# EAGLE design Teensy 3Gshield lower board V0.97 (EAGLE 7.2.0)
DESIGNER: Rob Oudendijk; VERSION: V0.96
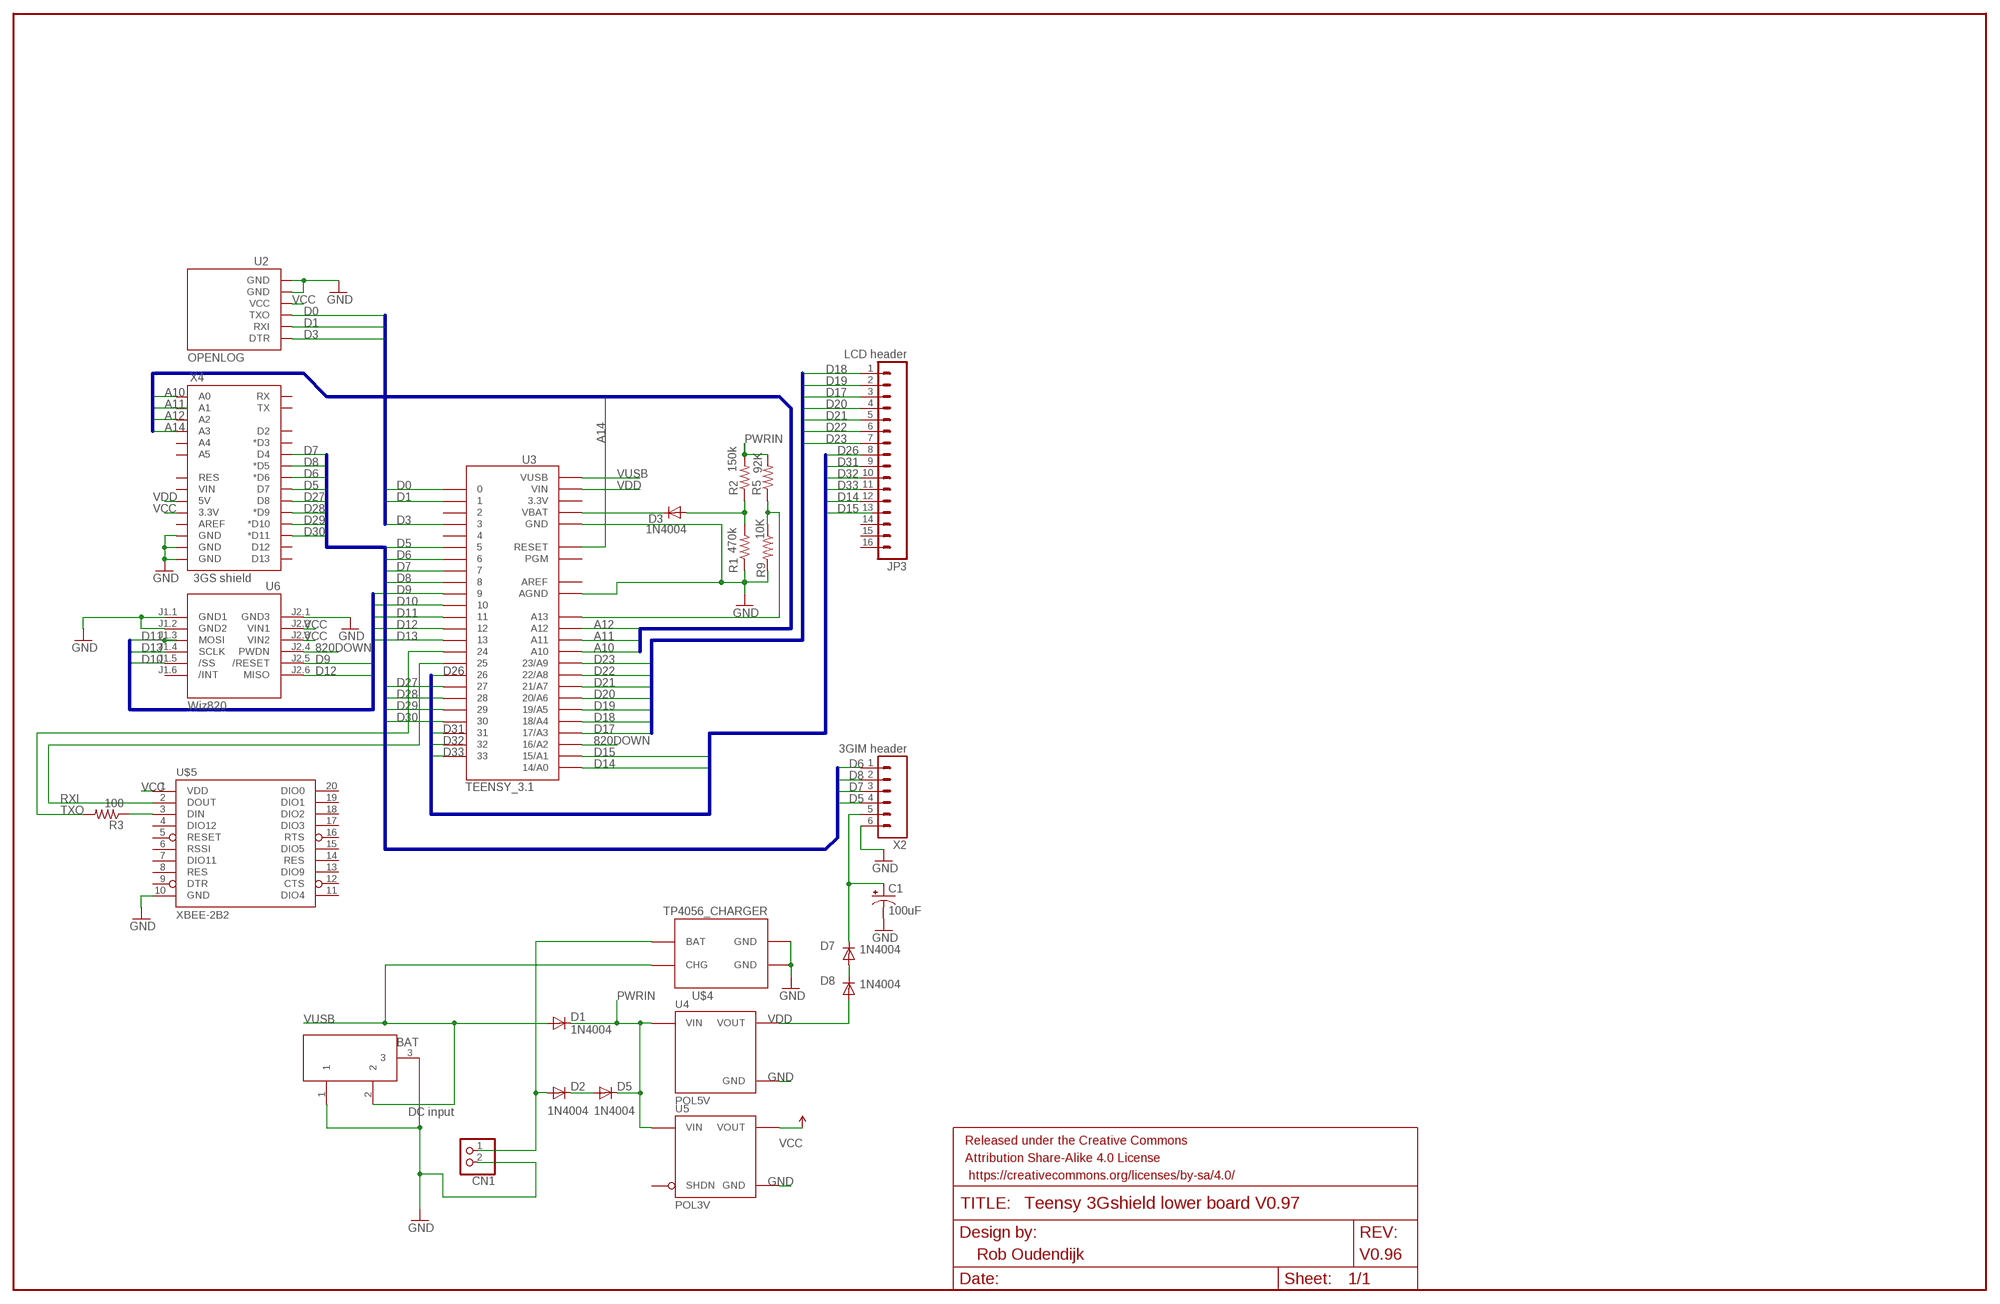
[diagram p0: schematic, sheet 1]

## Parts
C1  100uF  CAP_POLPTH1  [CPOL-RADIAL-100UF-25V]
CN1  JST_2PIN-THM-RA  [JST-PH-2-THM-RA]
D1  1N4004  [DO41-10]
D2  1N4004  [DO41-10]
D3  1N4004  [DO41-10]
D5  1N4004  [DO41-10]
D7  1N4004  [DO41-10]
D8  1N4004  [DO41-10]
DCINPUT  DC21MMX  [DC-21MM]
FRAME1  FRAME-LEDGER  [CREATIVE_COMMONS]
JP3  LCD header  M16PTH  [1X16]
R1  470k  RESISTOREZ  [AXIAL-0.3EZ]
R2  150k  RESISTOREZ  [AXIAL-0.3EZ]
R3  100  RESISTOREZ  [AXIAL-0.3EZ]
R5  92K  RESISTOREZ  [AXIAL-0.3EZ]
R9  10K  RESISTOREZ  [AXIAL-0.3EZ]
U2  OPENLOG  [OPENLOG]
U3  TEENSY_3.1  TEENSY_3.0_ALLPINS  [TEENSY_3.0_ALLPINS]
U4  POL5V  POLOLU_S7V8F5  [POLOLU_S7V8F5]
U5  POL3V  POLOLU_D24V3AXV  [POLOLU_D24VXAYV_HC]
U6  Wiz820  WIZ820IO_DEVICE'DUAL-IN-LINE'  [WIZ820IO]
U$4  TP4056_CHARGER  [TP4056]
U$5  XBEE-2B2  [XBEE-SILK]
X2  3GIM header  M06SILK_FEMALE_PTH  [1X06]
X4  3GS shield  ARDUINO_SHIELDLABEL  [DUEMILANOVE_SHIELD]

## Nets
820DOWN: U3.16/A2 U6.J2.4(PWDN)
A10: U3.A10 X4.A0
A11: U3.A11 X4.A1
A12: X4.A2
A14: U3.RESET X4.A3
BAT [VDD]: CN1.1 D2.A U$4.BAT
D0: U2.JP1$3(TXO) U3.0
D1: U2.JP1$2(RXI) U3.1
D3: U2.JP1$1(DTR) U3.3
D5: U3.5 X2.4 X4.D7
D6: U3.6 X2.1 X4.D6(*D6)
D7: U3.7 X2.3 X4.D4
D8: U3.8 X2.2 X4.D5(*D5)
D9: U3.9 U6.J2.5(/RESET)
D10: U3.10 U6.J1.5(/SS)
D11: U3.11 U6.J1.3(MOSI)
D12: U3.12 U6.J2.6(MISO)
D13: U3.13 U6.J1.4(SCLK)
D14: JP3.12 U3.14/A0
D15: U3.15/A1
D17: JP3.3 U3.17/A3
D18: JP3.1 U3.18/A4
D19: JP3.2 U3.19/A5
D20: JP3.4 U3.20/A6
D21: JP3.5 U3.21/A7
D22: JP3.6 U3.22/A8
D23: JP3.7 U3.23/A9
D26: JP3.8 U3.26
D27: U3.27 X4.D8
D28: U3.28 X4.D9(*D9)
D29: U3.29 X4.D10(*D10)
D30: U3.30 X4.D11(*D11)
D31: JP3.9 U3.31
D32: JP3.10 U3.32
D33: JP3.11 U3.33
GND [VCC]: C1.2(-) CN1.2 DCINPUT.1 DCINPUT.3 R1.P$1 R9.P$2 U2.JP1$5(GND) U2.JP1$6(GND) U3.AGND U3.GND U3.GND1(GND) U3.GND2(GND) U4.G(GND) U5.G(GND) U6.J1.1(GND1) U6.J1.2(GND2) U6.J2.1(GND3) U$4.GND U$4.GND2(GND) U$5.10(GND) X2.6 X4.GND@0(GND) X4.GND@1(GND) X4.GND@2(GND)
N$1: D3.C U3.VBAT
N$2: D3.A R1.P$2 R2.P$1
N$3: D2.C D5.A
N$8: R5.P$1 R9.P$1 U3.A13
N$10: R3.P$1 U$5.3(DIN)
N$31: D7.A D8.C
N$32: C1.1(+) D7.C X2.5
PWRIN [VDD]: D1.C D5.C R2.P$2 R5.P$2 U4.I(VIN) U5.I(VIN)
RXI: U3.25 U$5.2(DOUT)
TXO: R3.P$2 U3.24
VCC [VCC]: U2.JP1$4(VCC) U5.O(VOUT) U6.J2.2(VIN1) U6.J2.3(VIN2) U$5.1(VDD) X4.3.3V
VDD [VDD]: D8.A U3.VIN U4.O(VOUT) X4.5V
VUSB [VDD]: D1.A DCINPUT.2 U3.VUSB U$4.CHARGER(CHG)
Unconnected: JP3.13 JP3.14 JP3.15 JP3.16 U3.2 U3.3.3V U3.3.3V1(3.3V) U3.3.3V2(3.3V) U3.4 U3.A12 U3.PGM U5.S(SHDN) U6.J1.6(/INT) U$5.4(DIO12) U$5.5(RESET) U$5.6(RSSI) U$5.7(DIO11) U$5.8(RES) U$5.9(DTR) U$5.11(DIO4) U$5.12(CTS) U$5.13(DIO9) U$5.14(RES) U$5.15(DIO5) U$5.16(RTS) U$5.17(DIO3) U$5.18(DIO2) U$5.19(DIO1) U$5.20(DIO0) X4.A4 X4.A5 X4.AREF X4.D2 X4.D3(*D3) X4.D12 X4.D13 X4.RES X4.RX X4.TX X4.VIN

## Buses
D[17..23]
D[9..13]
D[0..3]
D[5..30]
A[10..14]
D[14..33]

## Notes on the sheet
- DC input

## Power pins joined to a net without a drawn wire
AREF: U3.AREF

## Library data of the parts
C1 = SparkFun-Capacitors:CAP_POL: Capacitor Polarized These are standard SMD and PTH capacitors. Normally 10uF, 47uF, and 100uF in electrolytic and tantalum varieties. Always verify the external diameter of the through hole cap, it varies with capacity, voltage, and manufacturer. The EIA devices should be standard.
CN1 = adafruit:JST_2PIN: JST 2-Pin Connectors of various flavors SMT-RA (S2B-PH-SM4) 4UConnector #17311 SMT (B2B-PH-SM4) THM-RA (S2B-PH) THM (B2B-PH)
D1-D3 D5 D7 D8 = adafruit:1N4004: DIODE General purpose 1N400x type rectifier (With bigger pads) http://www.ladyada.net/library/pcb/eaglelibrary.html
DCINPUT = powersupply:DC21MM
FRAME1 = SparkFun-Aesthetics:FRAME-LEDGER: Schematic Frame Standard 11x14 US Ledger frame
JP3 = SparkFun-Connectors:M16: 1x16 .1" header
R1-R3 = SparkFun-Resistors:RESISTOR: Resistor Basic schematic elements and footprints for 0603, 1206, and PTH resistors.
R5 R9 = SparkFun-Passives:RESISTOR: Resistor Basic schematic elements and footprints for 0603, 1206, and PTH resistors.
U2 = open_hw_sockets:OPENLOG: Openlog
U3 = Teensy3.0:TEENSY_3.0_ALLPINS: Teensy 3.0 with all pin holes and optional SMD-mount unshrouded header on bottom of Teensy 3.0. For more basic versions, see 'Basic', '+4' and 'AllAnalogPins'. Requires the installation of a un-shrouded SMD header on the underside of the Teensy 3.0
U4 = POLOLU1:POLOLU_S7V8F5: POLOLU_S7V8F5
U5 = Pololu:POLOLU_D24V3A*V: Pololu Adjustable Step Down Voltage Regulators Series D24V3A_V (300 mA) 0.4"x0.6" SOURCE www.pololu.com/ PACKAGE THT; 4-pin (0.1"); 0.4"x0.6" TECHNOLOGIES D24V3A…V Vi = (4.5…42)V Vo/V (Vo < Vi) X: (generic) L: (2.5… 7.5) H: (4.0…25.0) Io: 300 mA; Quiescent Current: 2 mA (SHDN: 20 uA) Author: Dipl.-Ing. FH Rainer Bayer
U6 = Wiz820io:WIZ820IO_DEVICE: WIZnet, WIZ820io plug in module incl. W5200 chip and MagJack
U$4 = open_hw_sockets:TP4056_CHARGER: TP4056
U$5 = SparkFun-RF:XBEE-2: Xbee module footprints SMT header is CONN-09042.
X2 = SparkFun-Connectors:M06: Header 6 Standard 6-pin 0.1" header. Use with straight break away headers (SKU : PRT-00116), right angle break away headers (PRT-00553), swiss pins (PRT-00743), machine pins (PRT-00117), and female headers (PRT-00115). Molex polarized connector foot print use with SKU : PRT-08094 with associated crimp pins and housings. NOTES ON THE VARIANTS LOCK and LOCK_LONGPADS... This footprint was designed to help hold the alignment of a through-hole component (i.e. 6-pin header) while soldering it into place. You may notice that each hole has been shifted either up or down by 0.005 of an inch from it's more standard position (which is a perfectly straight line). This slight alteration caused the pins (the squares in the middle) to touch the edges of the holes. Because they are alternating, it causes a "brace" to hold the component in place. 0.005 has proven to be the perfect amount of "off-center" position when using our standard breakaway headers. Although looks a little odd when you look at the bare footprint, once you have a header in there, the alteration is very hard to notice. Also,if you push a header all the way into place, it is covered up entirely on the bottom side. This idea of altering the position of holes to aid alignment will be further integrated into the Sparkfun Library for other footprints. It can help hold any component with 3 or more connection pins.; PROD_ID: CONN-08437
X4 = SparkFun-Boards:ARDUINO_SHIELD: Arduino shield footprint

## Net classes
0 default: width 0.406 mm, drill 0.254 mm, clearance 0.305 mm
1 VCC: width 0.7 mm, drill 0.254 mm, clearance 0.305 mm to class 0, clearance 0.205 mm
2 GND: width 0.7 mm, drill 0.254 mm, clearance 0.305 mm to class 0, clearance 0.205 mm to class 1
3 VDD: width 0.7 mm, drill 0.254 mm, clearance 0.305 mm to class 0, clearance 0.205 mm to class 1

## Board
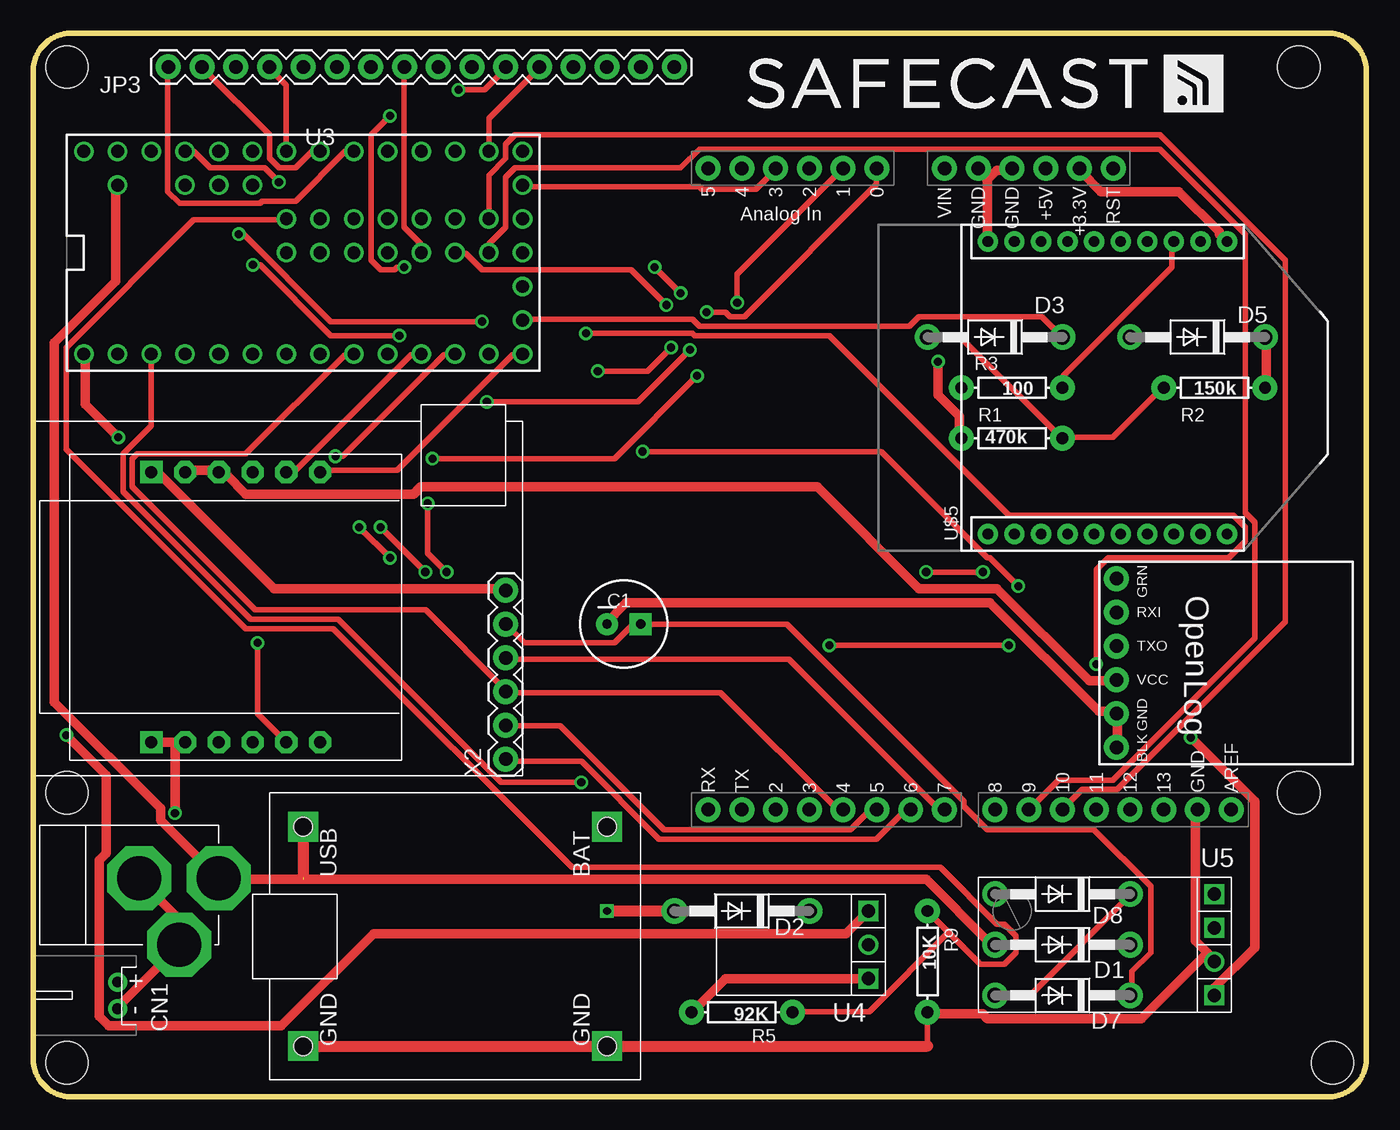
[diagram p1: board, top side]
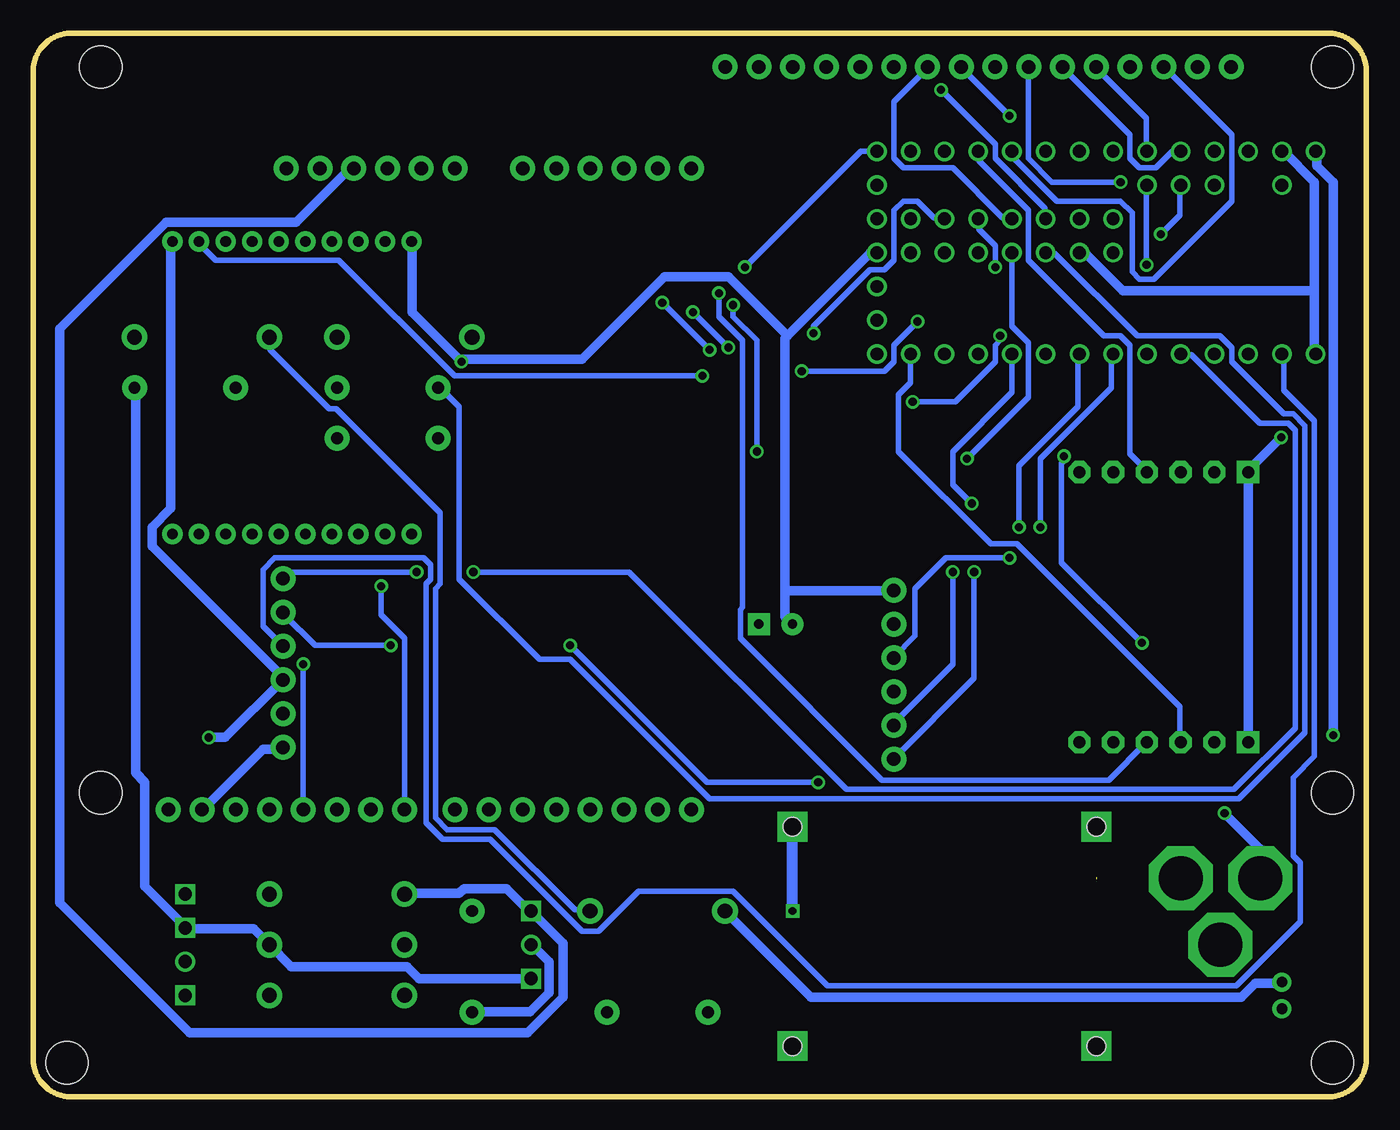
[diagram p2: board, bottom side, seen from below]

Size 100.33 x 80.01 mm. Coordinates in mm from the lower left corner, seen from the top.
Outline: 97.49,0 2.84,0 arc-90 0,2.84 0,77.17 arc-90 2.84,80.01 97.49,80.01 arc-90 100.33,77.17 100.33,2.84 arc-90 97.49,0
Copper layers (1*16): Top 0.035mm / dielectric 1.5mm / Bottom 0.035mm
Design rules "default": minimum track width 10mil, minimum drill 24mil, track to track 8mil, track to pad 8mil, pad to pad 8mil, via to via 8mil, smd to smd 8mil, copper to edge 40mil, drill to drill 8mil, minimum pad ring 10mil, minimum via ring 8mil, stop-mask expansion 4mil, vias tented up to drill 0mil, thermal gap 10mil
Holes 3.2 mm at 95.25,77.47 97.79,2.54 2.54,2.54 2.54,77.47 2.54,22.86 95.25,22.86

### Footprints (pad centres in the part's own frame; a part is rotated, then mirrored left to right if it is on the bottom)
CPOL-RADIAL-100UF-25V = drill 0.7 pad 1.651 square: 1 1.27,0 | drill 0.7 pad 1.651: 2 -1.27,0
JST-PH-2-THM-RA = drill 0.8 pad 1.422: 1 1,0; 2 -1,0
DO41-10 = drill 1.118 pad 1.93: A 5.08,0; C -5.08,0
DC-21MM = drill 3.302 pad 4.826 octagon: 1 -5.08,-3.353; 2 -0.076,-6.35; 3 -0.076,-0.356
1X16 = drill 1.016 pad 1.88: 1 0,0; 2 2.54,0; 3 5.08,0; 4 7.62,0; 5 10.16,0; 6 12.7,0; 7 15.24,0; 8 17.78,0; 9 20.32,0; 10 22.86,0; 11 25.4,0; 12 27.94,0; 13 30.48,0; 14 33.02,0; 15 35.56,0; 16 38.1,0
AXIAL-0.3EZ = drill 0.9 pad 1.88: P$1 -3.81,0; P$2 3.81,0
OPENLOG = drill 1.016 pad 1.88: JP1$1 1.27,1.27; JP1$2 3.81,1.27; JP1$3 6.35,1.27; JP1$4 8.89,1.27; JP1$5 11.43,1.27; JP1$6 13.97,1.27
TEENSY_3.0_ALLPINS = drill 0.965: 0 -7.62,13.97; 1 -7.62,11.43; 2 -7.62,8.89; 3 -7.62,6.35; 3.3V 7.62,11.43; 3.3V1 -2.54,-16.51; 3.3V2 2.54,-1.27; 4 -7.62,3.81; 5 -7.62,1.27; 6 -7.62,-1.27; 7 -7.62,-3.81; 8 -7.62,-6.35; 9 -7.62,-8.89; 10 -7.62,-11.43; 11 -7.62,-13.97; 12 -7.62,-16.51; 13 7.62,-16.51; 14/A0 7.62,-13.97; 15/A1 7.62,-11.43; 16/A2 7.62,-8.89; 17/A3 7.62,-6.35; 18/A4 7.62,-3.81; 19/A5 7.62,-1.27; 20/A6 7.62,1.27; 21/A7 7.62,3.81; 22/A8 7.62,6.35; 23/A9 7.62,8.89; 24 0,-3.81; 25 0,-6.35; 26 0,-8.89; 27 0,-11.43; 28 0,-13.97; 29 2.54,-13.97; 30 2.54,-11.43; 31 2.54,-8.89; 32 2.54,-6.35; 33 2.54,-3.81; A10 5.08,6.35; A11 5.08,3.81; A12 0,1.27; A13 2.54,1.27; AGND 7.62,13.97; AREF 5.08,8.89; GND -7.62,16.51; GND1 0,-16.51; GND2 0,-1.27; PGM 2.54,-16.51; RESET 5.08,-16.51; VBAT -5.08,-16.51; VIN 7.62,16.51; VUSB 5.08,13.97
POLOLU_S7V8F5 = drill 1: G 0,-5.715 | drill 1 square: I -2.54,-5.715; O 2.54,-5.715
POLOLU_D24VXAYV_HC = drill 1: G -1.27,-8.89 | drill 1 square: I 1.27,-8.89; O -3.81,-8.89; S 3.81,-8.89
WIZ820IO = drill 0.9 pad 1.676 square: J1.1 -10.16,6.35; J2.1 10.16,6.35 | drill 0.9 pad 1.676 octagon: J1.2 -10.16,3.81; J1.3 -10.16,1.27; J1.4 -10.16,-1.27; J1.5 -10.16,-3.81; J1.6 -10.16,-6.35; J2.2 10.16,3.81; J2.3 10.16,1.27; J2.4 10.16,-1.27; J2.5 10.16,-3.81; J2.6 10.16,-6.35
TP4056 = drill 1.5 square: BAT 7.62,-12.7; CHARGER 7.62,10.16; GND -8.89,10.16; GND2 -8.89,-12.7 | hole 1.4: -8.89,10.16; 7.62,10.16; 7.62,-12.7; -8.89,-12.7
XBEE-SILK = drill 0.8 pad 1.524: 1 -11,20; 2 -11,18; 3 -11,16; 4 -11,14; 5 -11,12; 6 -11,10; 7 -11,8; 8 -11,6; 9 -11,4; 10 -11,2; 11 11,2; 12 11,4; 13 11,6; 14 11,8; 15 11,10; 16 11,12; 17 11,14; 18 11,16; 19 11,18; 20 11,20
1X06 = drill 1.016 pad 1.88: 1 0,0; 2 2.54,0; 3 5.08,0; 4 7.62,0; 5 10.16,0; 6 12.7,0
DUEMILANOVE_SHIELD = drill 1.016 pad 1.88: 3.3V 12.7,27.94; 5V 10.16,27.94; A0 -2.54,27.94; A1 -5.08,27.94; A2 -7.62,27.94; A3 -10.16,27.94; A4 -12.7,27.94; A5 -15.24,27.94; AREF 24.13,-20.32; D2 -10.16,-20.32; D3 -7.62,-20.32; D4 -5.08,-20.32; D5 -2.54,-20.32; D6 0,-20.32; D7 2.54,-20.32; D8 6.35,-20.32; D9 8.89,-20.32; D10 11.43,-20.32; D11 13.97,-20.32; D12 16.51,-20.32; D13 19.05,-20.32; GND@0 7.62,27.94; GND@1 5.08,27.94; GND@2 21.59,-20.32; RES 15.24,27.94; RX -15.24,-20.32; TX -12.7,-20.32; VIN 2.54,27.94

### Placement (x,y rotation side)
C1  44.45,35.56 0 top
CN1  6.35,7.62 90 top
D1  77.47,11.43 180 top
D2  53.34,13.97 180 top
D3  72.39,57.15 180 top
D5  87.63,57.15 180 top
D7  77.47,7.62 180 top
D8  77.47,15.24 180 top
DCINPUT  7.62,16.51 90 top
FRAME1  74.93,66.67 0 top
JP3  10.16,77.47 0 top
R1  73.66,49.53 0 top
R2  88.9,53.34 0 top
R3  73.66,53.34 180 top
R5  53.34,6.35 180 top
R9  67.31,10.16 270 top
U2  80.25,40.26 270 top
U3  20.32,63.5 90 top
U4  57.15,11.43 90 top
U5  80.01,11.43 90 top
U6  15.24,36.83 90 top
U$4  30.48,12.7 90 top
U$5  69.85,53.34 270 top
U$10  [SAFECAST_LOGO1]  53.34,73.66 0 top
X2  35.56,25.4 90 top
X4  66.04,41.91 0 top

### Tracks (layer width: path | path; a pad name or v marks a point on that pad's centre or on a via)
820DOWN
  Bottom 0.406: U3.16/A2 29.16,71.12 29.16,70.41 25.43,66.67 25.43,62.94 19.74,57.25 18.49,57.25 17.78,56.54 17.78,48.36 16.54,47.12 U6.J2.4
A10  (via drill 0.61)
  Top 0.406: v15.47,64.9 15.82,64.9 22.4,58.32 v33.78,58.32 | v42.49,54.59 46.23,54.59 v48.01,56.36 | v50.67,59.03 52.09,59.03 52.45,58.67 53.52,58.67 63.48,68.63 63.48,69.7 X4.A0
  Bottom 0.406: v15.47,64.9 14.05,66.32 14.05,68.45 U3.A10 | v33.78,58.32 35.56,56.54 35.56,55.3 36.27,54.59 v42.49,54.59 | v50.67,59.03 v48.01,56.36
A11  (via drill 0.61)
  Top 0.406: v16.54,62.59 17.07,62.59 22.4,57.25 v27.56,57.25 | v34.14,52.27 45.52,52.27 v49.43,56.19 | v52.98,59.74 52.98,61.87 X4.A1
  Bottom 0.406: v16.54,62.59 16.54,68.45 U3.A11 | v27.56,57.25 27.56,56.9 27.91,56.54 27.91,55.3 30.94,52.27 v34.14,52.27 | v52.98,59.74 v49.43,56.19
A14
  Top 0.406: U3.RESET 36.98,68.45 50.14,68.45 50.32,68.28 54.41,68.28 55.83,69.7 X4.A3
BAT  (via drill 0.6)
  Top 0.813: D2.A v43.18,13.97
  Bottom 0.7: CN1.1 6.4,8.53 8.36,8.53 9.42,7.47 41.78,7.47 48.18,13.87 D2.A
  Bottom 0.813: v43.18,13.97 U$4.BAT
D0
  Bottom 0.406: U3.0 6.22,55.83 6.22,53.16 3.91,50.85 3.91,25.6 5.51,24 5.51,18.14 4.98,17.6 4.98,13.16 9.78,8.36 40.54,8.36 47.65,15.47 54.76,15.47 57.78,12.45 59.03,12.45 65.96,19.38 69.52,19.38 70.76,20.62 70.76,38.58 70.41,38.94 70.41,40.01 70.94,40.54 82.14,40.54 83.03,39.65 83.03,35.38 81.61,33.96 U2.JP1$3
D1  (via drill 0.61)
  Top 0.406: U3.1 8.89,50.49 6.76,48.36 6.76,45.52 16.36,35.92 22.94,35.92 35.2,23.65 v41.25,23.65 | v73.43,33.96 v59.92,33.96
  Bottom 0.406: v41.25,23.65 49.61,23.65 v59.92,33.96 | v73.43,33.96 79.12,33.96 81.43,36.27 U2.JP1$2
D3  (via drill 0.61)
  Top 0.406: v71.48,39.47 v67.21,39.47
  Bottom 0.406: v67.21,39.47 55.47,39.47 39.12,23.11 9.96,23.11 5.33,27.74 5.33,50.14 5.87,50.67 8,50.67 13.16,55.83 13.87,55.83 U3.3 | v71.48,39.47 81.08,39.47 81.43,39.12 U2.JP1$1
D5  (via drill 0.61)
  Top 0.406: v26.85,40.54 v24.54,42.85 | X4.D7 68.45,21.69 68.1,21.69 56.9,32.89 35.56,32.89 X2.4
  Bottom 0.406: v24.54,42.85 24.54,48.01 19.2,53.34 19.2,55.83 U3.5 | v26.85,40.54 31.65,40.54 33.96,38.23 33.96,34.67 35.56,33.07 X2.4
D6  (via drill 0.61)
  Top 0.406: v29.52,39.47 v26.14,42.85 | X4.D6 65.96,21.51 65.61,21.51 63.48,19.38 47.12,19.38 41.25,25.25 35.56,25.25 X2.1
  Bottom 0.406: v26.14,42.85 26.14,47.47 21.69,51.92 21.69,55.83 U3.6 | v29.52,39.47 29.52,31.47 35.56,25.43 X2.1
D7
  Top 0.406: U3.7 24,55.83 23.47,55.83 16,48.36 7.82,48.36 7.47,48.01 7.47,45.87 16.71,36.63 29.52,36.63 35.56,30.58 X2.3 35.74,30.4 51.74,30.4 60.45,21.69 60.81,21.69 X4.D4
D8  (via drill 0.61)
  Top 0.406: v29.69,44.63 29.69,40.89 v31.11,39.47 | X4.D5 63.48,21.51 62.94,21.51 61.52,20.09 47.47,20.09 39.65,27.91 35.56,27.91 X2.2
  Bottom 0.406: U3.8 26.67,52.98 31.11,48.54 31.11,46.05 v29.69,44.63 | v31.11,39.47 31.11,32.54 35.56,28.09 X2.2
D9
  Top 0.406: U3.9 29.16,55.83 28.45,55.83 19.74,47.12 19.2,47.12 U6.J2.5
D10  (via drill 0.61)
  Top 0.406: v22.76,48.18 23.29,48.18 30.94,55.83 31.65,55.83 U3.10 | v16.89,34.14 16.89,28.8 19.02,26.67 U6.J1.5
  Bottom 0.406: v22.76,48.18 22.76,47.83 22.94,47.65 22.94,40.18 v16.89,34.14
D11
  Bottom 0.406: U3.11 34.31,55.83 34.31,53.7 35.2,52.81 35.2,48.54 28.27,41.6 26.31,41.6 14.05,29.34 14.05,26.67 U6.J1.3
D12
  Top 0.406: U3.12 36.8,55.83 36.09,55.83 27.38,47.12 21.69,47.12 U6.J2.6
D13  (via drill 0.61)
  Top 0.406: v48.72,60.45 v46.76,62.41
  Bottom 0.406: U3.13 38.05,71.12 v46.76,62.41 | v48.72,60.45 48.72,58.67 46.94,56.9 46.94,36.8 47.12,36.63 47.12,34.49 36.45,23.82 19.38,23.82 16.54,26.67 U6.J1.4
D14
  Top 0.406: U3.14/A0 34.31,71.12 34.31,73.61 38.05,77.34 JP3.12
D17
  Bottom 0.406: U3.17/A3 26.67,70.76 23.29,67.39 18.49,67.39 17.6,66.5 17.6,62.05 17.07,61.52 16,61.52 10.13,67.39 10.13,72.36 JP3.3
D18
  Top 0.406: U3.18/A4 23.47,71.12 19.74,67.39 17.25,67.39 17.07,67.21 11.02,67.21 10.13,68.1 10.13,77.34 JP3.1
D19
  Top 0.406: U3.19/A5 20.98,71.12 19.74,69.88 18.49,69.88 17.78,70.59 17.78,72.36 12.8,77.34 JP3.2
D20
  Top 0.406: U3.20/A6 19.02,71.12 19.02,76.1 17.78,77.34 JP3.4
D21
  Bottom 0.406: U3.21/A7 16.54,71.12 16.54,73.61 20.27,77.34 JP3.5
D22
  Bottom 0.406: U3.22/A8 14.58,71.12 15.82,69.88 17.07,69.88 17.78,70.59 17.78,72.36 22.76,77.34 JP3.6
D23  (via drill 0.61)
  Top 0.406: U3.23/A9 12.09,71.12 13.34,69.88 17.42,69.88 v18.49,68.81
  Bottom 0.406: v18.49,68.81 23.65,68.81 25.43,70.59 25.43,77.34 JP3.7
D26
  Top 0.406: U3.26 29.16,63.65 29.16,64.19 27.91,65.43 27.91,77.34 JP3.8
D27  (via drill 0.61)
  Top 0.406: v47.65,59.56 44.98,62.23 33.78,62.23 32.54,63.48 31.83,63.48 U3.27 | v45.87,48.54 63.83,48.54 71.83,40.54 72.01,40.54 v74.14,38.41
  Bottom 0.406: v47.65,59.56 47.65,58.67 45.87,56.9 v45.87,48.54 | v74.14,38.41 74.14,36.27 72.36,34.49 72.36,21.69 X4.D8
D28
  Top 0.406: X4.D9 77.17,23.82 81.25,23.82 91.92,34.49 91.92,43.2 91.21,43.92 91.21,64.9 84.81,71.3 50.14,71.3 48.72,69.88 36.27,69.88 35.56,69.16 35.56,65.43 34.31,64.19 34.31,63.65 U3.28
D29
  Top 0.406: U3.29 34.31,66.14 34.31,69.34 35.56,70.59 35.56,71.65 36.27,72.36 84.81,72.36 94.23,62.94 94.23,35.74 81.61,23.11 78.94,23.11 77.52,21.69 X4.D10
D30  (via drill 0.61)
  Top 0.406: v41.6,57.43 49.61,57.43 49.78,57.25 59.92,57.25 73.43,43.74 90.32,43.74 91.21,42.85 91.21,41.78 89.97,40.54 80.9,40.54 80.01,39.65 v80.01,32.54
  Bottom 0.406: v41.6,57.43 41.6,57.96 37.34,62.23 36.27,62.23 35.56,62.94 35.56,66.67 34.85,67.39 33.78,67.39 32.54,66.14 31.83,66.14 U3.30 | X4.D11 v80.01,32.54
D31  (via drill 0.61)
  Top 0.406: v27.91,62.41 27.38,62.41 27.2,62.23 26.14,62.23 25.43,62.94 25.43,72.36 v26.85,73.79
  Bottom 0.406: v27.91,62.41 27.91,64.01 29.16,65.25 29.16,65.96 U3.31 | v26.85,73.79 30.4,77.34 JP3.9
D32
  Bottom 0.406: U3.32 26.67,66.14 27.38,66.14 31.11,69.88 34.85,69.88 35.56,70.59 35.56,74.85 33.07,77.34 JP3.10
D33  (via drill 0.61)
  Top 0.406: v32,75.74 33.96,75.74 35.56,77.34 JP3.11
  Bottom 0.406: v32,75.74 27.91,71.65 27.91,70.59 24.18,66.85 24.18,66.14 U3.33
GND  (via drill 0.61)
  Top 0.406: 67.31,3.81 R9.P$2
  Top 0.7: U2.JP1$6 81.61,26.31 81.61,28.8 U2.JP1$5 81.25,28.98 80.19,28.98 72.01,37.16 44.63,37.16 43.03,35.56 C1.2 | 88.37,10.85 87.48,11.73 87.48,21.51 X4.GND@2 | 88.37,10.85 88.9,10.31 U5.G | 88.37,10.85 83.39,5.87 71.83,5.87 71.48,6.22 67.39,6.22 R9.P$2 | CN1.2 6.4,6.76 11.02,11.38 DCINPUT.1 10.85,11.73 10.85,13.51 8,16.36 DCINPUT.3 | 71.83,68.99 71.83,64.36 U$5.10 | 71.83,68.99 71.12,69.7 X4.GND@1 | v68.1,55.3 68.1,52.81 69.7,51.21 69.7,49.61 R1.P$1 | 71.83,68.99 72.54,69.7 73.61,69.7 X4.GND@0 | U6.J1.1 U6.J1.2 10.67,26.49 v10.67,21.34 | U6.J2.1 8.89,46.94 9.42,46.94 18.14,38.23 35.56,38.23 X2.6 | v6.4,49.61 3.91,52.09 3.91,55.83 U3.GND
  Top 0.813: 67.31,3.81 U$4.GND2 U$4.GND
  Bottom 0.7: U4.G 62.76,11.38 61.52,10.13 61.52,7.82 62.94,6.4 67.21,6.4 R9.P$2 | U2.JP1$6 81.61,26.14 83.03,26.14 87.48,21.69 X4.GND@2 | 3.91,60.63 3.91,68.81 6.22,71.12 U3.AGND | 3.91,60.63 3.91,56.01 U3.GND | 3.91,60.63 18.31,60.63 21.16,63.48 21.51,63.48 U3.GND2 | U$5.10 71.83,64.19 71.83,59.03 v68.1,55.3 67.92,55.47 59.03,55.47 52.81,61.7 48.01,61.7 43.56,57.25 | U6.J1.1 U6.J2.1 8.71,47.3 v6.4,49.61 | 43.56,57.25 43.74,57.07 43.74,38.05 | 43.56,57.25 37.34,63.48 36.98,63.48 U3.GND1 | 43.74,38.05 43.74,36.09 43.2,35.56 C1.2 | 43.74,38.05 35.56,38.05 X2.6 | v10.67,21.34 8,18.67 8,16.54 DCINPUT.3
N$1
  Top 0.406: U3.VBAT 36.98,58.5 49.61,58.5 50.14,57.96 65.96,57.96 66.67,58.67 75.92,58.67 77.34,57.25 D3.C
N$2
  Top 0.406: R2.P$1 84.99,53.34 81.25,49.61 77.52,49.61 R1.P$2 77.34,49.61 69.88,57.07 67.39,57.07 D3.A
N$3
  Bottom 0.406: D2.C 58.5,14.05 59.56,14.05 65.61,20.09 69.16,20.09 70.05,20.98 70.05,38.23 69.7,38.58 69.7,43.92 77.52,51.74 78.05,51.74 82.5,56.19 82.5,57.07 D5.A
N$8
  Top 0.406: 68.9,12.36 67.39,13.87 R9.P$1 | 68.9,12.36 71.3,9.96 73.08,9.96 73.97,10.85 73.97,12.09 73.08,12.98 72.54,12.98 68.28,17.25 40.54,17.25 22.58,35.2 16,35.2 2.49,48.72 2.49,56.36 12.09,65.96 19.02,65.96 U3.A13 | 68.9,12.36 62.94,6.4 57.25,6.4 R5.P$1
N$10
  Top 0.406: U$5.3 85.7,64.19 85.7,62.41 77.52,54.23 77.52,53.34 R3.P$1
N$31
  Top 0.406: D7.A 72.54,7.64 75.03,7.64 82.5,15.11 D8.C
N$32
  Top 0.406: X2.5 36.98,34.14 43.74,34.14 45.16,35.56 C1.1 56.72,35.56 70.05,22.23 70.05,21.87 71.83,20.09 79.83,20.09 84.1,15.82 84.1,10.85 82.68,9.42 82.68,7.64 D7.C
PWRIN
  Top 0.7: U4.I 52.09,8.89 49.61,6.4 R5.P$2 | R2.P$2 92.81,53.34 92.81,57.07 D5.C
  Bottom 0.7: R2.P$2 92.63,53.34 92.63,24.36 91.92,23.65 91.92,15.82 89.08,12.98 U5.I 88.9,12.62 83.74,12.62 D1.C 80.9,9.78 72.19,9.78 71.3,8.89 U4.I
RXI  (via drill 0.61)
  Top 0.406: v30.05,48.01 43.74,48.01 v49.96,54.23
  Bottom 0.406: U3.25 26.67,57.96 25.43,56.72 25.43,52.63 v30.05,48.01 | v49.96,54.23 68.63,54.23 77.34,62.94 86.59,62.94 87.83,64.19 U$5.2
TXO
  Bottom 0.406: U3.24 24,63.48 23.47,63.48 17.25,57.25 11.02,57.25 10.13,56.36 10.13,55.3 6.22,51.38 5.51,51.38 4.62,50.49 4.62,27.38 9.6,22.4 49.43,22.4 59.92,32.89 62.23,32.89 68.28,38.94 68.28,51.92 69.7,53.34 R3.P$2
VCC  (via drill 0.61)
  Top 0.7: U$5.1 89.79,64.36 89.26,64.9 89.26,65.08 86.23,68.1 80.37,68.1 78.77,69.7 X4.3.3V | U6.J2.2 11.56,47.12 13.87,47.12 U6.J2.3 14.22,46.76 14.58,46.76 16,45.34 28.63,45.34 29.16,45.87 59.03,45.87 66.67,38.23 72.54,38.23 79.48,31.29 81.43,31.29 U2.JP1$4 | U5.O 88.9,8.18 91.92,11.2 91.92,22.23 v87.12,27.03
  Bottom 0.7: v87.12,27.03 85.88,27.03 81.61,31.29 U2.JP1$4 81.61,31.65 91.39,41.43 91.39,42.85 89.97,44.27 89.97,64.19 U$5.1
VDD  (via drill 0.61)
  Top 0.7: v2.49,27.2 5.51,24.18 5.51,18.31 4.98,17.78 4.98,6.04 5.69,5.33 18.67,5.33 25.6,12.27 61.16,12.27 U4.O
  Bottom 0.7: v2.49,27.2 2.49,68.81 3.73,70.05 3.73,71.12 U3.VIN | X4.5V 76.28,69.7 76.63,69.7 80.54,65.79 90.32,65.79 98.32,57.78 98.32,14.58 88.54,4.8 63.12,4.8 60.45,7.47 60.45,11.56 U4.O 63.12,14.05 64.72,15.65 67.92,15.65 68.28,15.29 72.36,15.29 D8.A
VUSB  (1 unrouted)
  Top 0.7: U3.VUSB 6.22,68.45 6.22,61.34 1.6,56.72 1.6,29.69 9.6,21.69 9.6,20.8 DCINPUT.2 14.22,16.36 67.21,16.36 72.01,11.56 72.36,11.56 D1.A
  Top 0.813: U$4.CHARGER 20.32,16.51

### Text on the board
tDocu: nGeigieKit V2.0